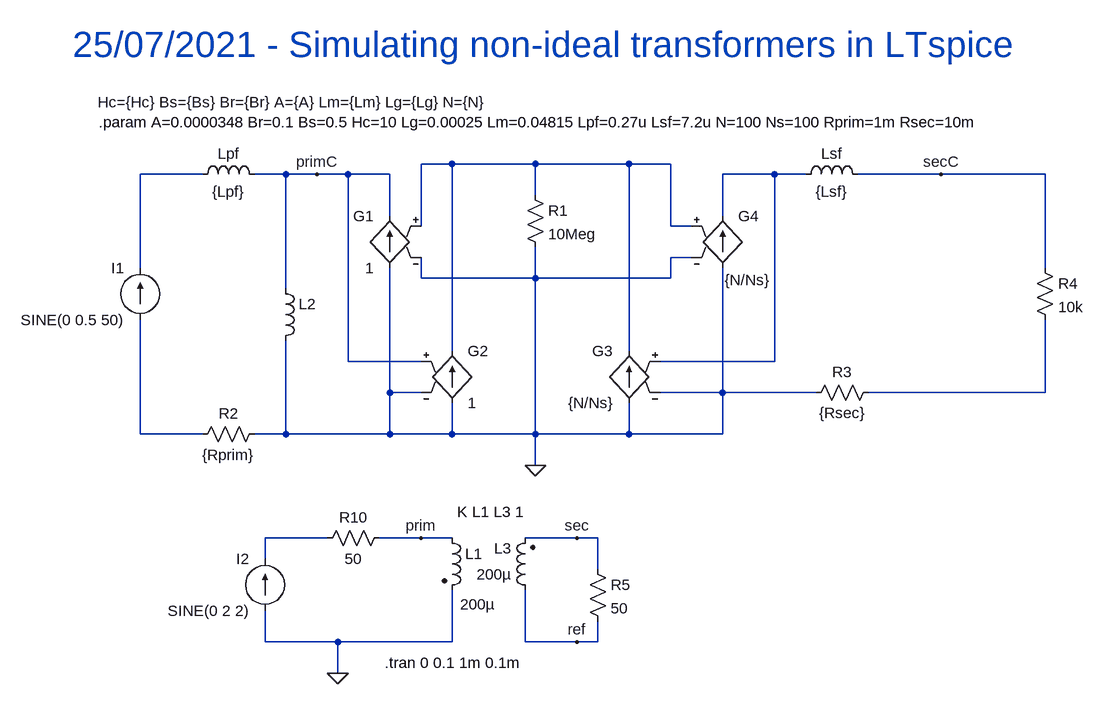
[diagram p0: schematic Non-linear_transformer.asc]
Non-linear_transformer.asc, the LTspice schematic file:
Version 4
SHEET 1 1140 680
WIRE 64 -416 16 -416
WIRE 192 -416 64 -416
WIRE 336 -416 192 -416
WIRE 400 -416 336 -416
WIRE -320 -400 -416 -400
WIRE -192 -400 -240 -400
WIRE -144 -400 -192 -400
WIRE -96 -400 -144 -400
WIRE -32 -400 -96 -400
WIRE 560 -400 480 -400
WIRE 608 -400 560 -400
WIRE 816 -400 688 -400
WIRE 976 -400 816 -400
WIRE 192 -368 192 -416
WIRE -32 -336 -32 -400
WIRE 480 -336 480 -400
WIRE 16 -320 16 -416
WIRE 400 -320 400 -416
WIRE 432 -320 400 -320
WIRE 432 -272 400 -272
WIRE -416 -256 -416 -400
WIRE 976 -256 976 -400
WIRE 16 -240 16 -272
WIRE 192 -240 192 -288
WIRE 192 -240 16 -240
WIRE 400 -240 400 -272
WIRE 400 -240 192 -240
WIRE -192 -224 -192 -400
WIRE 64 -128 64 -416
WIRE 336 -128 336 -416
WIRE -96 -112 -96 -400
WIRE 16 -112 -96 -112
WIRE 560 -112 560 -400
WIRE 560 -112 384 -112
WIRE -32 -64 -32 -256
WIRE 16 -64 -32 -64
WIRE 480 -64 480 -256
WIRE 480 -64 384 -64
WIRE 624 -64 480 -64
WIRE 976 -64 976 -176
WIRE 976 -64 704 -64
WIRE -416 0 -416 -176
WIRE -320 0 -416 0
WIRE -192 0 -192 -144
WIRE -192 0 -240 0
WIRE -32 0 -32 -64
WIRE -32 0 -192 0
WIRE 64 0 64 -48
WIRE 64 0 -32 0
WIRE 192 0 192 -240
WIRE 192 0 64 0
WIRE 336 0 336 -48
WIRE 336 0 192 0
WIRE 480 0 480 -64
WIRE 480 0 336 0
WIRE 192 48 192 0
WIRE -128 160 -224 160
WIRE 16 160 -48 160
WIRE 64 160 16 160
WIRE 256 160 176 160
WIRE 288 160 256 160
WIRE -224 192 -224 160
WIRE 288 208 288 160
WIRE -224 320 -224 272
WIRE -112 320 -224 320
WIRE 64 320 64 240
WIRE 64 320 -112 320
WIRE 176 320 176 240
WIRE 256 320 176 320
WIRE 288 320 288 288
WIRE 288 320 256 320
WIRE -112 368 -112 320
FLAG 192 48 0
FLAG -112 368 0
FLAG 16 160 prim
FLAG 256 160 sec
FLAG 256 320 ref
FLAG -144 -400 primC
FLAG 816 -400 secC
SYMBOL g -32 -352 M0
SYMATTR InstName G1
SYMATTR Value 1
SYMBOL g 336 -144 M0
SYMATTR InstName G3
SYMATTR Value {N/Ns}
SYMBOL g 64 -144 R0
SYMATTR InstName G2
SYMATTR Value 1
SYMBOL g 480 -352 R0
WINDOW 3 3 115 Left 2
SYMATTR Value {N/Ns}
SYMATTR InstName G4
SYMBOL ind 592 -384 R270
WINDOW 0 32 56 VTop 2
WINDOW 3 5 56 VBottom 2
SYMATTR InstName Lsf
SYMATTR Value {Lsf}
SYMBOL res 176 -384 R0
SYMATTR InstName R1
SYMATTR Value 10Meg
SYMBOL ind -336 -384 R270
WINDOW 0 32 56 VTop 2
WINDOW 3 5 56 VBottom 2
SYMATTR InstName Lpf
SYMATTR Value {Lpf}
SYMBOL ind -208 -240 R0
WINDOW 3 -273 -271 Left 2
SYMATTR Value Hc={Hc} Bs={Bs} Br={Br} A={A} Lm={Lm} Lg={Lg} N={N}
SYMATTR InstName L2
SYMBOL res -224 -16 R90
WINDOW 0 0 56 VBottom 2
WINDOW 3 32 56 VTop 2
SYMATTR InstName R2
SYMATTR Value {Rprim}
SYMBOL res 720 -80 R90
WINDOW 0 0 56 VBottom 2
WINDOW 3 32 56 VTop 2
SYMATTR InstName R3
SYMATTR Value {Rsec}
SYMBOL res 960 -272 R0
SYMATTR InstName R4
SYMATTR Value 10k
SYMBOL ind2 48 144 R0
WINDOW 3 28 118 Left 2
SYMATTR Value 200µ
SYMATTR InstName L1
SYMATTR Type ind
SYMBOL ind2 192 256 R180
WINDOW 0 36 80 Left 2
WINDOW 3 36 40 Left 2
SYMATTR InstName L3
SYMATTR Value 200µ
SYMATTR Type ind
SYMBOL res 272 192 R0
SYMATTR InstName R5
SYMATTR Value 50
SYMBOL res -32 144 R90
WINDOW 0 0 56 VBottom 2
WINDOW 3 32 56 VTop 2
SYMATTR InstName R10
SYMATTR Value 50
SYMBOL current -416 -176 R180
WINDOW 0 24 80 Left 2
WINDOW 3 24 0 Left 2
WINDOW 123 0 0 Left 0
WINDOW 39 0 0 Left 0
SYMATTR InstName I1
SYMATTR Value SINE(0 0.5 50)
SYMBOL current -224 272 R180
WINDOW 0 24 80 Left 2
WINDOW 3 24 0 Left 2
WINDOW 123 0 0 Left 0
WINDOW 39 0 0 Left 0
SYMATTR InstName I2
SYMATTR Value SINE(0 2 2)
TEXT -40 352 Left 2 !.tran 0 0.1 1m 0.1m
TEXT 72 120 Left 2 !K L1 L3 1
TEXT -480 -480 Left 2 !.param A=0.0000348 Br=0.1 Bs=0.5 Hc=10 Lg=0.00025 Lm=0.04815 Lpf=0.27u Lsf=7.2u N=100 Ns=100 Rprim=1m Rsec=10m
TEXT -520 -600 Left 5 ;25/07/2021 - Simulating non-ideal transformers in LTspice

The netlist it stands for:
* Non-linear_transformer.asc
G1 0 primC N001 0 1
G3 0 N001 N003 0 {N/Ns}
G2 0 N001 primC 0 1
G4 0 N003 N001 0 {N/Ns}
Lsf N003 secC {Lsf}
R1 N001 0 10Meg
Lpf N002 primC {Lpf}
L2 primC 0 Hc={Hc} Bs={Bs} Br={Br} A={A} Lm={Lm} Lg={Lg} N={N}
R2 0 N005 {Rprim}
R3 N004 0 {Rsec}
R4 secC N004 10k
L1 prim 0 200µ
L3 ref sec 200µ
R5 sec ref 50
R10 prim N006 50
I1 N005 N002 SINE(0 0.5 50)
I2 0 N006 SINE(0 2 2)
.tran 0 0.1 1m 0.1m
K L1 L3 1
.param A=0.0000348 Br=0.1 Bs=0.5 Hc=10 Lg=0.00025 Lm=0.04815 Lpf=0.27u Lsf=7.2u N=100 Ns=100 Rprim=1m Rsec=10m
* 25/07/2021 - Simulating non-ideal transformers in LTspice
.backanno
.end